# Altium schematic sheet ETH.SchDoc
size 420 x 297 mm; Address1: Address1; Address2: Address2; Address3: Address3; Address4: Address4; SheetNumber: 1; Scale: 1:1; Разраб.: Иванов; Обозначение документа: АБВГ.123456.001 Э3; Пров.: Петров; Утв.: Сидоров; Наименование организации: ОАО "Концерн "МПО-Гидроприбор"; Перв. применение: АБВГ.123456.000; Наименование изделия 1: Плата; Наименование изделия 2: Схема электрическая; Наименование изделия 3: принципиальная; Нач. отд.: Нач. отд.; Фамилия нач. отд.: Сидоров
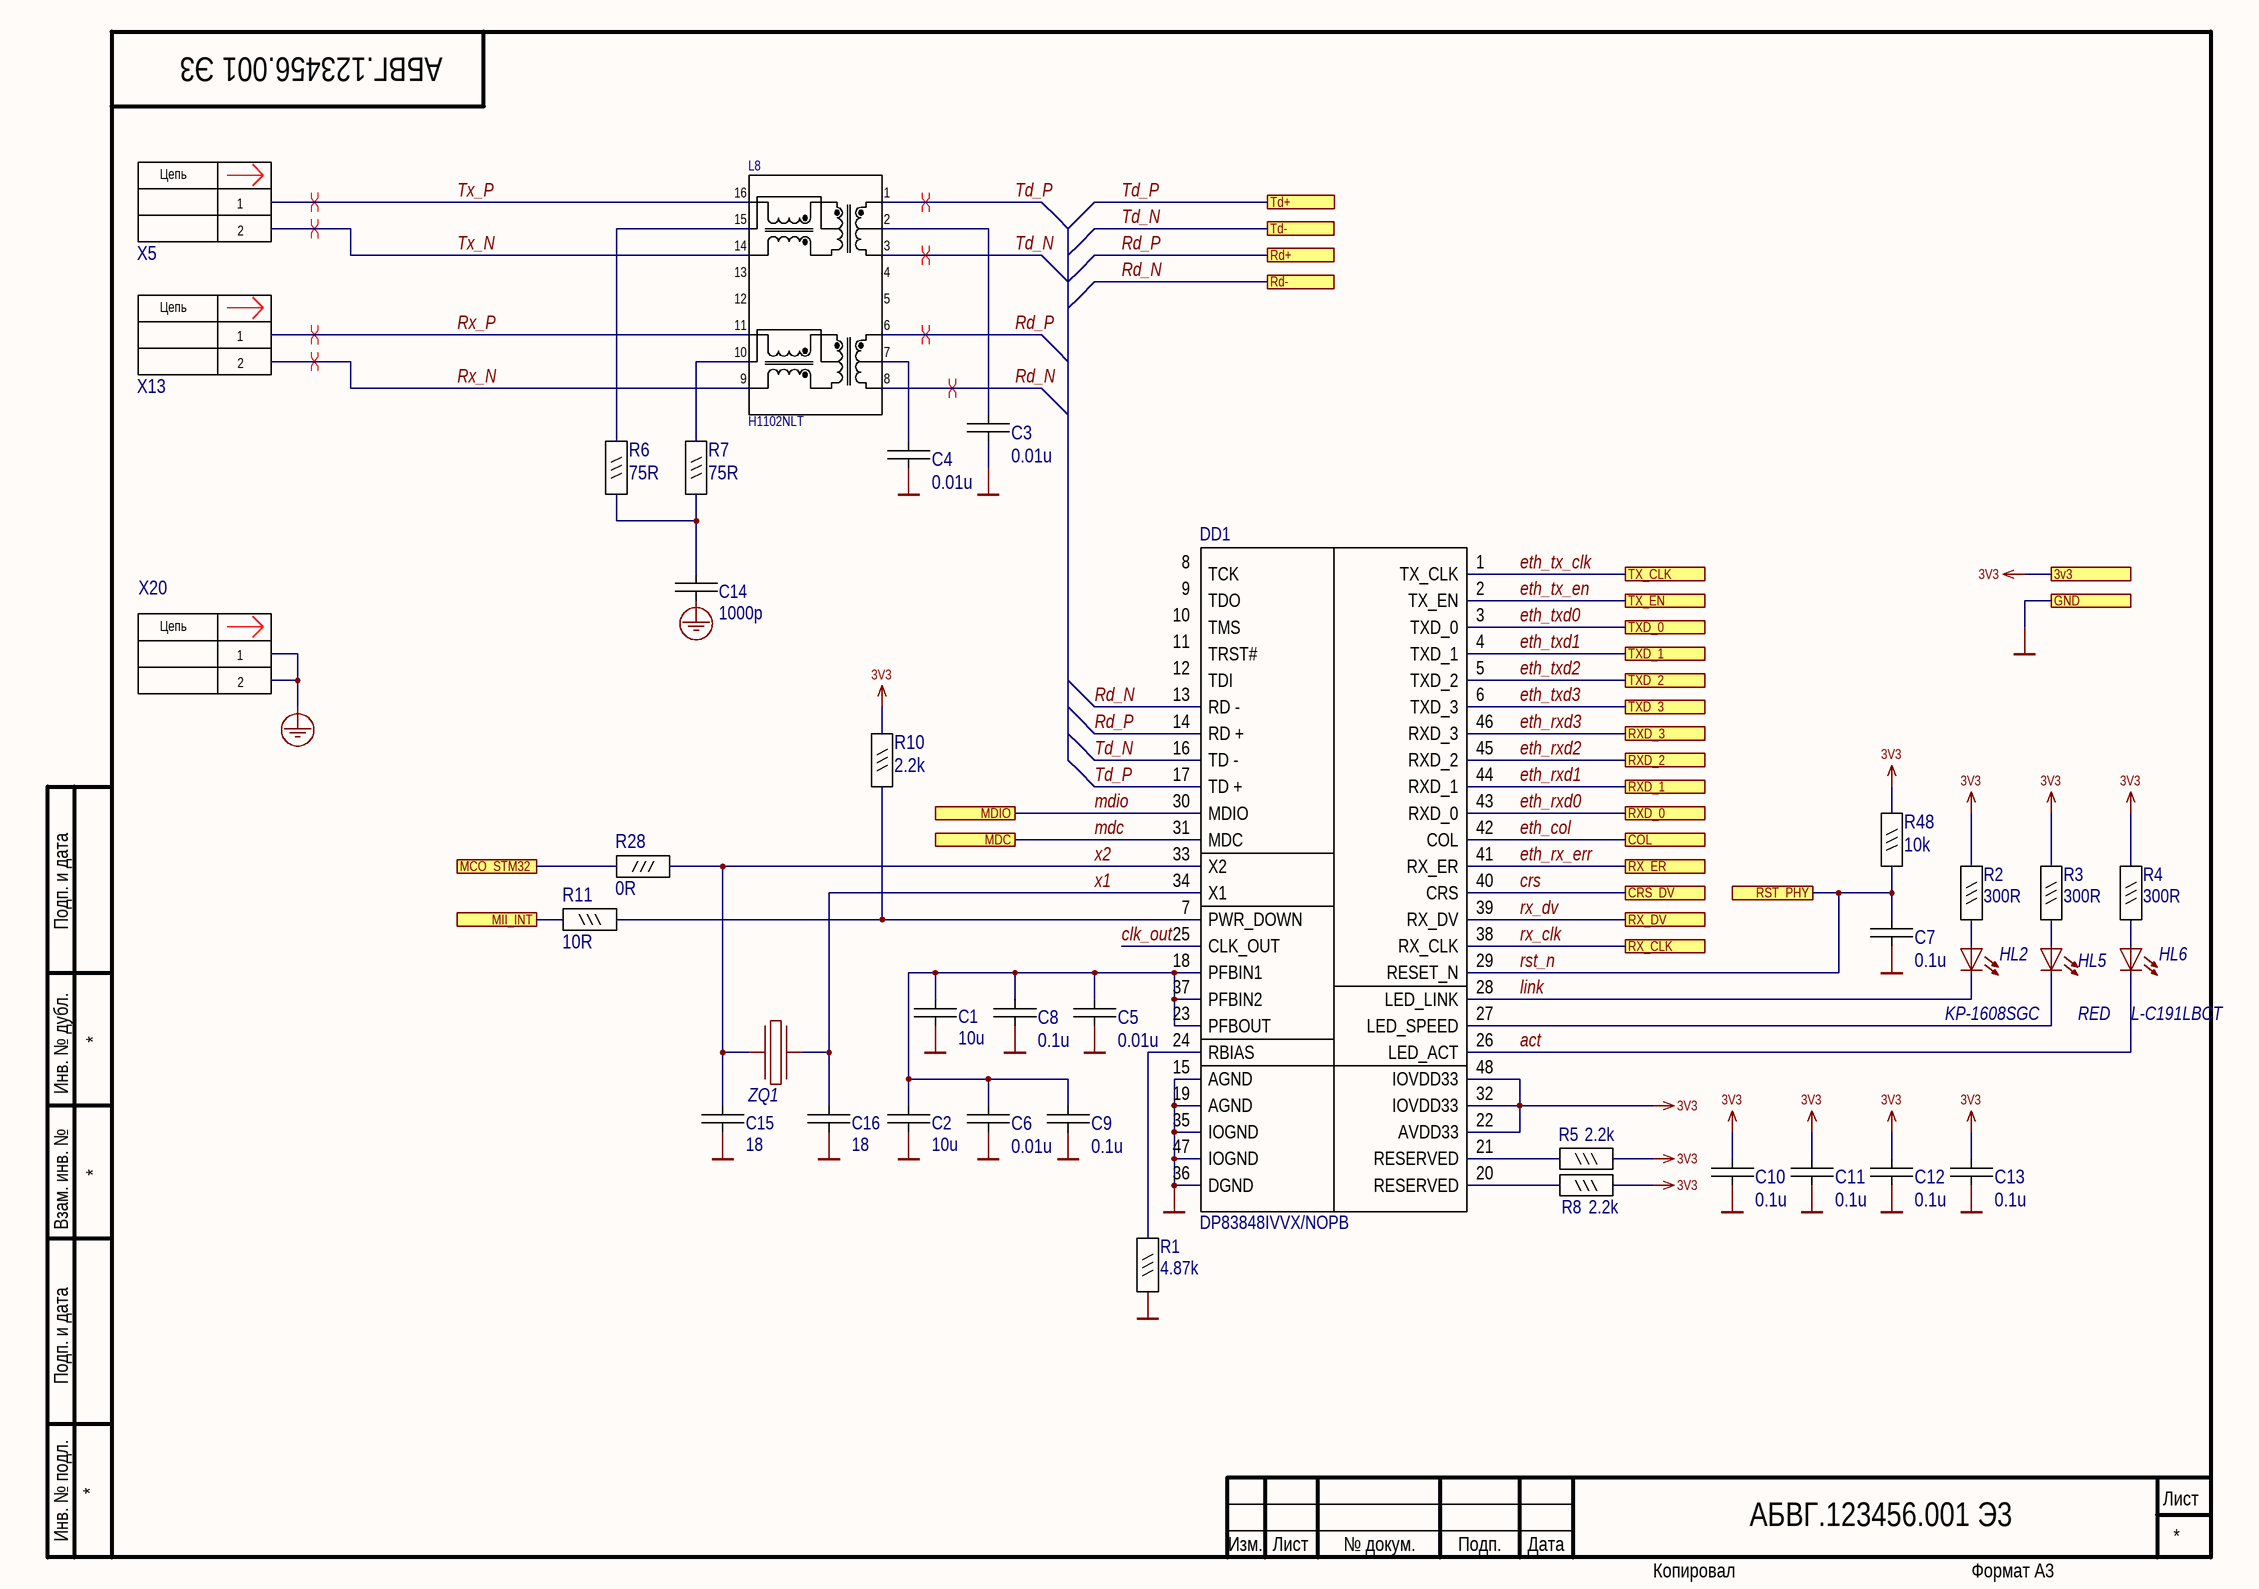
[diagram p0: ETH.SchDoc]

## Parts
C1  10u  [C0805_IPC]
C2  10u  [C0805_IPC]
C3  0.01u  [C0603_IPC]
C4  0.01u  [C0603_IPC]
C5  0.01u  [C0603_IPC]
C6  0.01u  [C0603_IPC]
C7  0.1u  [C0603_IPC]
C8  0.1u  [C0603_IPC]
C9  0.1u  [C0603_IPC]
C10  0.1u  [C0603_IPC]
C11  0.1u  [C0603_IPC]
C12  0.1u  [C0603_IPC]
C13  0.1u  [C0603_IPC]
C14  1000p  [C1206_IPC]
C15  18  [C0603_IPC]
C16  18  [C0603_IPC]
DD1  DP83848IVVX/NOPB  [LQFP48]
HL2  KP-1608SGC  [led0603green]
HL5  RED  [LED0603red]
HL6  L-C191LBCT  [led0603blue]
L8  H1102NLT  [H1102NLT]
R1  4.87k  [R0603]
R2  300R  [R0603]
R3  300R  [R0603]
R4  300R  [R0603]
R5  2.2k  [R0603]
R6  75R  [R0603]
R7  75R  [R0603]
R8  2.2k  [R0603]
R10  2.2k  [R0603]
R11  10R  [R0603]
R28  0R  [R0603]
R48  10k  [R0603]
X5  308-021-14  [2pin 2.54 screw vert]  (value not drawn)
X13  308-021-14  [2pin 2.54 screw vert]  (value not drawn)
X20  308-021-14  [2pin 2.54 screw vert]  (value not drawn)
ZQ1  ABM3C-25.000MHZ-D4Y-T  [5x3.2]  (value not drawn)

## Ports
3v3, COL, CRS_DV, GND, MCO_STM32, MDC, MDIO, MII_INT, Rd+, Rd-, RST_PHY, RX_CLK, RX_DV, RX_ER, RXD_0, RXD_1, RXD_2, RXD_3, Td+, Td-, TX_CLK, TX_EN, TXD_0, TXD_1, TXD_2, TXD_3

## Nets
3V3: C10.1 C11.1 C12.1 C13.1 DD1.22(AVDD33) DD1.32(IOVDD33) DD1.48(IOVDD33) R2.2 R3.2 R4.2 R5.2 R8.2 R10.2 R48.1 ; port 3v3
EARTH: C14.2 X20.1 X20.2
GND: C1.2 C2.2 C3.2 C4.2 C5.2 C6.2 C7.2 C8.2 C9.2 C10.2 C11.2 C12.2 C13.2 C15.2 C16.2 DD1.15(AGND) DD1.19(AGND) DD1.35(IOGND) DD1.36(DGND) DD1.47(IOGND) R1.1 ; port GND
act: DD1.26(LED_ACT) HL6.2
clk_out: DD1.25(CLK_OUT)
crs: DD1.40(CRS) ; port CRS_DV
eth_col: DD1.42(COL) ; port COL
eth_rx_err: DD1.41(RX_ER) ; port RX_ER
eth_rxd0: DD1.43(RXD_0) ; port RXD_0
eth_rxd1: DD1.44(RXD_1) ; port RXD_1
eth_rxd2: DD1.45(RXD_2) ; port RXD_2
eth_rxd3: DD1.46(RXD_3) ; port RXD_3
eth_tx_clk: DD1.1(TX_CLK) ; port TX_CLK
eth_tx_en: DD1.2(TX_EN) ; port TX_EN
eth_txd0: DD1.3(TXD_0) ; port TXD_0
eth_txd1: DD1.4(TXD_1) ; port TXD_1
eth_txd2: DD1.5(TXD_2) ; port TXD_2
eth_txd3: DD1.6(TXD_3) ; port TXD_3
link: DD1.28(LED_LINK) HL2.2
MCO_STM32: R28.2 ; port MCO_STM32
mdc: DD1.31(MDC) ; port MDC
mdio: DD1.30(MDIO) ; port MDIO
MII_INT: R11.1 ; port MII_INT
Rd_N: DD1.13(RD_-) L8.8 ; port Rd-
Rd_P: DD1.14(RD_+) L8.6 ; port Rd+
rst_n: C7.1 DD1.29(RESET_N) R48.2 ; port RST_PHY
rx_clk: DD1.38(RX_CLK) ; port RX_CLK
rx_dv: DD1.39(RX_DV) ; port RX_DV
Rx_N: L8.9 X13.2
Rx_P: L8.11 X13.1
Td_N: DD1.16(TD_-) L8.3 ; port Td-
Td_P: DD1.17(TD_+) L8.1 ; port Td+
Tx_N: L8.14 X5.2
Tx_P: L8.16 X5.1
x1: C16.1 DD1.34(X1) ZQ1.3
x2: C15.1 DD1.33(X2) R28.1 ZQ1.1
NetC1_1: C1.1 C2.1 C5.1 C6.1 C8.1 C9.1 DD1.18(PFBIN1) DD1.23(PFBOUT) DD1.37(PFBIN2)
NetC3_1: C3.1 L8.2
NetC4_1: C4.1 L8.7
NetC14_1: C14.1 R6.1 R7.1
NetDD1_7: DD1.7(PWR_DOWN) R10.1 R11.2
NetDD1_20: DD1.20(RESERVED) R8.1
NetDD1_21: DD1.21(RESERVED) R5.1
NetDD1_24: DD1.24(RBIAS) R1.2
NetDD1_27: DD1.27(LED_SPEED) HL5.2
NetHL2_1: HL2.1 R2.1
NetHL5_1: HL5.1 R3.1
NetHL6_1: HL6.1 R4.1
NetL8_10: L8.10 R7.2
NetL8_15: L8.15 R6.2

Not connected (* = marked no-connect by the designer): DD1 8(TCK) 9(TDO) 10(TMS) 11(TRST#) 12(TDI); L8 4 5 12 13

## Layout directives
differential pair: Rd_N, Rd_P, Rx_N, Rx_P, Td_N, Td_P, Tx_N, Tx_P

## Notes on the sheet
- 5611-8804-321-H  Цена розничная: 53,00 руб. Цена мелкооптовая: 41,94 руб. Наличие на складе: 870 шт
  http://www.dart.moscow/getfile.php?jpg=true&did=201706&fid=JATBSwtK2LzOdow1kKwH3u7i143oLVKhu3yk98qs0ck.jpg
  BS-RB10005 (HR933123HE)
  Разъем RJ-45 с фильтром и светодиодами Наличие на складе: 10 шт Цена розничная: 48,00 руб. Цена мелкооптовая: 39,15 руб.
  http://www.dart.moscow/index.php?productcode=177710
  http://www.kosmodrom.com.ua/pdf/HR911105A.pdf
- Подп. и дата
- Инв. № дубл.
- Взам. инв. №
- Инв. № подл.
- Изм.
- Лист
- № докум.
- Подп.
- Дата
- Копировал
- Формат А3
- (in symbol 2p screw 2,54mm vert) Цепь

## Library data of the parts
C1 C2 = 10u 10V: 10µF ±10% 10V Ceramic Capacitor X7R 0805 (2012 Metric); MPN: CL21B106KPQNNNE; Manufacturer: Yageo; Name: 10u 10V; Tolerance: 0,1; Value: 10u; Voltage/Power: 10V; LibraryPath: sch\cap.schlib; FootprintPath: pcb\capSmd.pcblib; ComponentLink2URL: https://www.digikey.com/product-detail/en/samsung-electro-mechanics/CL21B106KPQNNNE/1276-1764-2-ND/3887422; ComponentLink2Description: site; Type: X7R; price elitan 1000pc: 2.23; price terra 1000pc: 2.5
C3-C6 = 0.01u 50V: 0.01uF ±10% 50V Ceramic Capacitor X7R 0603 (1608 Metric); MPN: CC0603KRX7R9BB103; Manufacturer: Yageo; Tolerance: 0,1; PartNumber: 0.01u 50V; Value: 0.01u; Voltage/Power: 50V; LibraryPath: _library\sch\cap.schlib; FootprintPath: _library\pcb\capSmd.pcblib; ComponentLink2URL: https://www.digikey.com/product-detail/en/yageo/CC0603KRX7R9BB103/311-1085-2-ND/302819; ComponentLink2Description: site; Type: X7R; price elitan 1000pc: 0.54; price terra 1000pc: 0.62
C7-C13 = 0.1u 50V: 0.1uF ±10% 50V Ceramic Capacitor X7R 0603 (1608 Metric); MPN: CL10B104KB8NNND; Manufacturer: Samsung; Tolerance: 0,1; PartNumber: 0.1u 50V; Value: 0.1u; Voltage/Power: 50V; LibraryPath: _library\sch\cap.schlib; FootprintPath: _library\pcb\capSmd.pcblib; ComponentLink2URL: https://www.digikey.com/product-detail/en/yageo/CC0603KRX7R9BB104/311-1344-2-ND/2103082; ComponentLink2Description: site; Type: X7R; price elitan 1000pc: 0.63; price terra 1000pc: 0.65
C14 = 1000p 2kV: 1000pF ±5% 2000V (2kV) Ceramic Capacitor C0G, NP0 1206 (3216 Metric); MPN: CC1206KKX7RDBB102; Manufacturer: Yageo; Tolerance: 0,05; analogue: 1206GC102KAT1A; Name: 1000p 2kV; Value: 1000p; Voltage/Power: 2kV; ComponentLink2URL: https://www.digikey.com/product-detail/en/yageo/CC1206KKX7RDBB102/311-1487-2-ND/2833652; ComponentLink2Description: site; Type: NP0; price elitan 1000pc: 3.49; price terra 1000pc: 2.1; price chipdip 1000pc: 4.1; LibraryPath: sch\cap.schlib; FootprintPath: pcb\capSmd.pcblib
C15 C16 = 18p 50V: 18pF ±5% 50V Ceramic Capacitor C0G, NP0 0603 (1608 Metric); MPN: CC0603JRNPO9BN180; Manufacturer: Yageo; Name: 18p 50V; Tolerance: 0,05; Type: C0G/NPO; Value: 18; Voltage/Power: 50V; LibraryPath: _library\sch\cap.schlib; FootprintPath: _library\pcb\capSmd.pcblib; ComponentLink2URL: https://www.digikey.com/product-detail/en/yageo/CC0603JRNPO9BN180/311-1061-2-ND/302795; ComponentLink2Description: site; price elitan 1000pc: 0.62; price terra 1000pc: 0.65
DD1 = DP83848IVVX/NOPB: 1/1 Transceiver Ethernet 48-LQFP (7x7); Manufacturer: Texas Instruments; ComponentLink1Description: DataSheet; ComponentLink1URL: C:\DATASHEET\Ethernet\dp83848i.pdf; Name: DP83848IVVX/NOPB; MPN: DP83848IVVX/NOPB; ComponentLink2URL: https://www.digikey.com/product-detail/en/texas-instruments/DP83848IVVX-NOPB/DP83848IVVX-NOPBCT-ND/3440157; ComponentLink2Description: site; price elitan 1000pc: 207
HL2 = Green0603: 1.6 x 0.8 mm SMD Chip LED Lamp, The Super Bright Green, Forward Voltage IF = 2.2V@20mA; Manufacturer: Kingbright; analogue: APT1608SGC, BT19-2132UBGC (BL-HG636D 0603 GREEN); Name: Green0603; MPN: KP-1608SGC; Value: Green; ComponentLink2URL: https://www.kingbright.com/attachments/file/psearch/000/00/00/KP-1608SGC(Ver.23B).pdf; ComponentLink2Description: site; Voltage/Power: Forward Voltage IF = 2.2V@20mA; LibraryPath: _library\sch\led.SchLib; FootprintPath: _library\pcb\led.pcblib; price elitan 1000pc: 3.0; price terra 1000pc: 3.5; price chipdip 1000pc: 3.6; price dart 1000pc: 0.7
HL5 = KP-1608SURC: KP-1608SURC, Светодиод красный 150 мКд SMD0603; MPN: KP-1608SURC
HL6 = Blue0603: 1.6 x 0.8 mm SMD Chip LED Lamp, The Hyper Red, Forward Voltage IF = 1.95V@20mA; Manufacturer: Para Light Electronics Co. Ltd.(PARA); Value: Blue; analogue: TO-1608BC-BF, FYLS-0603UBC, KPH-1608PBC-A, BT19-2132UBC; Name: Blue0603; MPN: L-C191LBCT; ComponentLink2URL: http://www.paralighttaiwan.com/web/portfolio-view/l-c191xxxx-1-6x0-8x0-6mm-surface-mount-device-led-0603/; ComponentLink2Description: site; Voltage/Power: Forward Voltage IF = 1.95V@20mA; LibraryPath: _library\sch\led.SchLib; FootprintPath: _library\pcb\led.pcblib; price elitan 1000pc: 2.07; price terra 1000pc: 2.7; price chipdip 1000pc: 3; price dart 1000pc: 0.9
L8 = H1102NLT: Isolation and Data Interface (Encapsulated) Pulse Transformer 1:1 Transmitter, 1:1 Receiver Surface Mount; Manufacturer: Pulse Electronics Network; Name: H1102NLT; MPN: H1102NLT; ComponentLink2URL: https://www.digikey.com/product-detail/en/pulse-electronics-network/H1102NLT/553-1532-2-ND/2265467; ComponentLink2Description: site; price elitan 1000pc: 42.6; price terra 1000pc: 71.38; price chipdip 1000pc: 50.9; LibraryPath: _library\sch\transistors.schlib; FootprintPath: _library\pcb\transistors.pcblib
R1 = 4.87k 1%: 4.87 kOhms ±1% 0.1W, 1/10W Chip Resistor 0603 (1608 Metric) Moisture Resistant Thick Film; MPN: RC0603FR-074K87L; Manufacturer: yageo; Voltage/Power: 0.063; Name: 4.87k 1%; Value: 4.87k; Tolerance: 1%; ComponentLink2URL: https://www.digikey.com/product-detail/en/yageo/RC0603FR-074K87L/311-4.87KHRTR-ND/727217; ComponentLink2Description: site; price elitan 1000pc: 0.19; price terra 1000pc: 0.22; LibraryPath: sch\res.Schlib; FootprintPath: pcb\resSmd.pcblib
R2-R4 = 300R 5%: 300 Ohms ±5% 0.1W, 1/10W Chip Resistor 0603 (1608 Metric) Moisture Resistant Thick Film; MPN: RC0603JR-07300RL; Manufacturer: yageo; Name: 300R 5%; Voltage/Power: 0.063; Value: 300R; Tolerance: 5%; ComponentLink2URL: https://www.digikey.com/product-detail/en/yageo/RC0603JR-07300RL/311-300GRTR-ND/726765; ComponentLink2Description: site; price elitan 1000pc: 0.17; price terra 1000pc: 0.15; LibraryPath: sch\res.schlib; FootprintPath: pcb\resSmd.pcblib
R5 R8 R10 = 2k2 5%: 2.2 kOhms ±5% 0.1W, 1/10W Chip Resistor 0603 (1608 Metric) Moisture Resistant Thick Film; MPN: RC0603JR-072k2L; Manufacturer: yageo; Name: 2k2 5%; Voltage/Power: 0.063; Value: 2.2k; Tolerance: 5%; ComponentLink2URL: https://www.digikey.com/product-detail/en/yageo/RC0603JR-072K2L/311-2.2KGRTR-ND/726729; ComponentLink2Description: site; price elitan 1000pc: 0.17; price terra 1000pc: 0.15
  R5 R8: LibraryPath: sch\res.schlib; FootprintPath: pcb\resSmd.pcblib
  R10: LibraryPath: _library\sch\; FootprintPath: _library\pcb\resSmd.pcblib
R6 R7 = 75R 5%: 75 Ohms ±5% 0.1W, 1/10W Chip Resistor 0603 (1608 Metric) Moisture Resistant Thick Film; MPN: RC0603JR-0775RL; Manufacturer: yageo; Name: 75R 5%; Voltage/Power: 0.063; Value: 75R; Tolerance: 5%; ComponentLink2URL: https://www.digikey.com/product-detail/en/yageo/RC0603JR-0775RL/311-75GRTR-ND/726827; ComponentLink2Description: site; price elitan 1000pc: 0.26; price terra 1000pc: 0.23; LibraryPath: _library\sch\; FootprintPath: _library\pcb\resSmd.pcblib
R11 = 10R 5%: 10 Ohms ±5% 0.1W, 1/10W Chip Resistor 0603 (1608 Metric) Moisture Resistant Thick Film; MPN: RC0603JR-0710RL; Manufacturer: yageo; Name: 10R 5%; Voltage/Power: 0.063; Value: 10R; Tolerance: 5%; ComponentLink2URL: https://www.digikey.com/product-detail/en/yageo/RC0603JR-0710RL/311-10GRTR-ND/726699; ComponentLink2Description: site; price elitan 1000pc: 0.26; price terra 1000pc: 0.23; LibraryPath: _library\sch\; FootprintPath: _library\pcb\resSmd.pcblib
R28 = 0R: 0 Ohms Jumper 0.1W, 1/10W Chip Resistor 0603 (1608 Metric) Moisture Resistant Thick Film; MPN: RC0603FR-070RL; Manufacturer: yageo; Voltage/Power: 0.063; Name: 0R; Value: 0R; Tolerance: Jumper; ComponentLink2URL: https://www.digikey.com/product-detail/en/yageo/RC0603FR-070RL/311-0.0HRTR-ND/1304008; ComponentLink2Description: site; price elitan 1000pc: 0.26; price terra 1000pc: 0.23; LibraryPath: _library\sch\; FootprintPath: _library\pcb\resSmd.pcblib
R48 = R0603: MPN: AC0603FR-0710KL; Value: 10k
X5 X13 X20 = 2p screw 2,54mm vert: 250V/8A, 0,8кв.мм (18AWG), Клеммник винтовой, 2-контактный, 5мм, прямой; Manufacturer: KLS electronic; analogue: XY308-2.54-02P, DG308-2.54-02P-14-00AH, KF128-2.54-02P-14, 282834-2, OSTVN02A150, 2138; Voltage/Power: 300V/16A; Name: 2p screw 2,54mm vert; MPN: 308-021-14; ComponentLink2URL: https://www.te.com/commerce/DocumentDelivery/DDEController?Action=srchrtrv&DocNm=282834&DocType=Customer+Drawing&DocLang=English; ComponentLink2Description: site; price elitan 1000pc: 7.07; price terra 1000pc: 9.1; price chipdip 1000pc: 12; price dart 1000pc: 12.26; LibraryPath: _library\sch\connectors.schlib; FootprintPath: _library\pcb\connectors_terminal.pcblib
ZQ1 = 25MHz GYR 5x3.2: 25MHz ±30ppm Crystal 18pF 50 Ohms 4-SMD, No Lead; Manufacturer: Abracon LLC; Load Cap: 18p; MPN: ABM3C-25.000MHZ-D4Y-T; PartNumber: 25MHz GYR 5x3.2; Value: 25MHz; LibraryPath: _library\sch\crystal.schlib; FootprintPath: _library\pcb\crystal.pcblib; ComponentLink2URL: https://www.digikey.com/product-detail/en/abracon-llc/ABM3C-25.000MHZ-D4Y-T/535-11296-2-ND/2639897; ComponentLink2Description: site; Type: MHz Crystal; price elitan 1000pc: 24.7; price terra 1000pc: 25